# EAGLE design Logical_EPS v.1.0 (EAGLE 9.2.2)
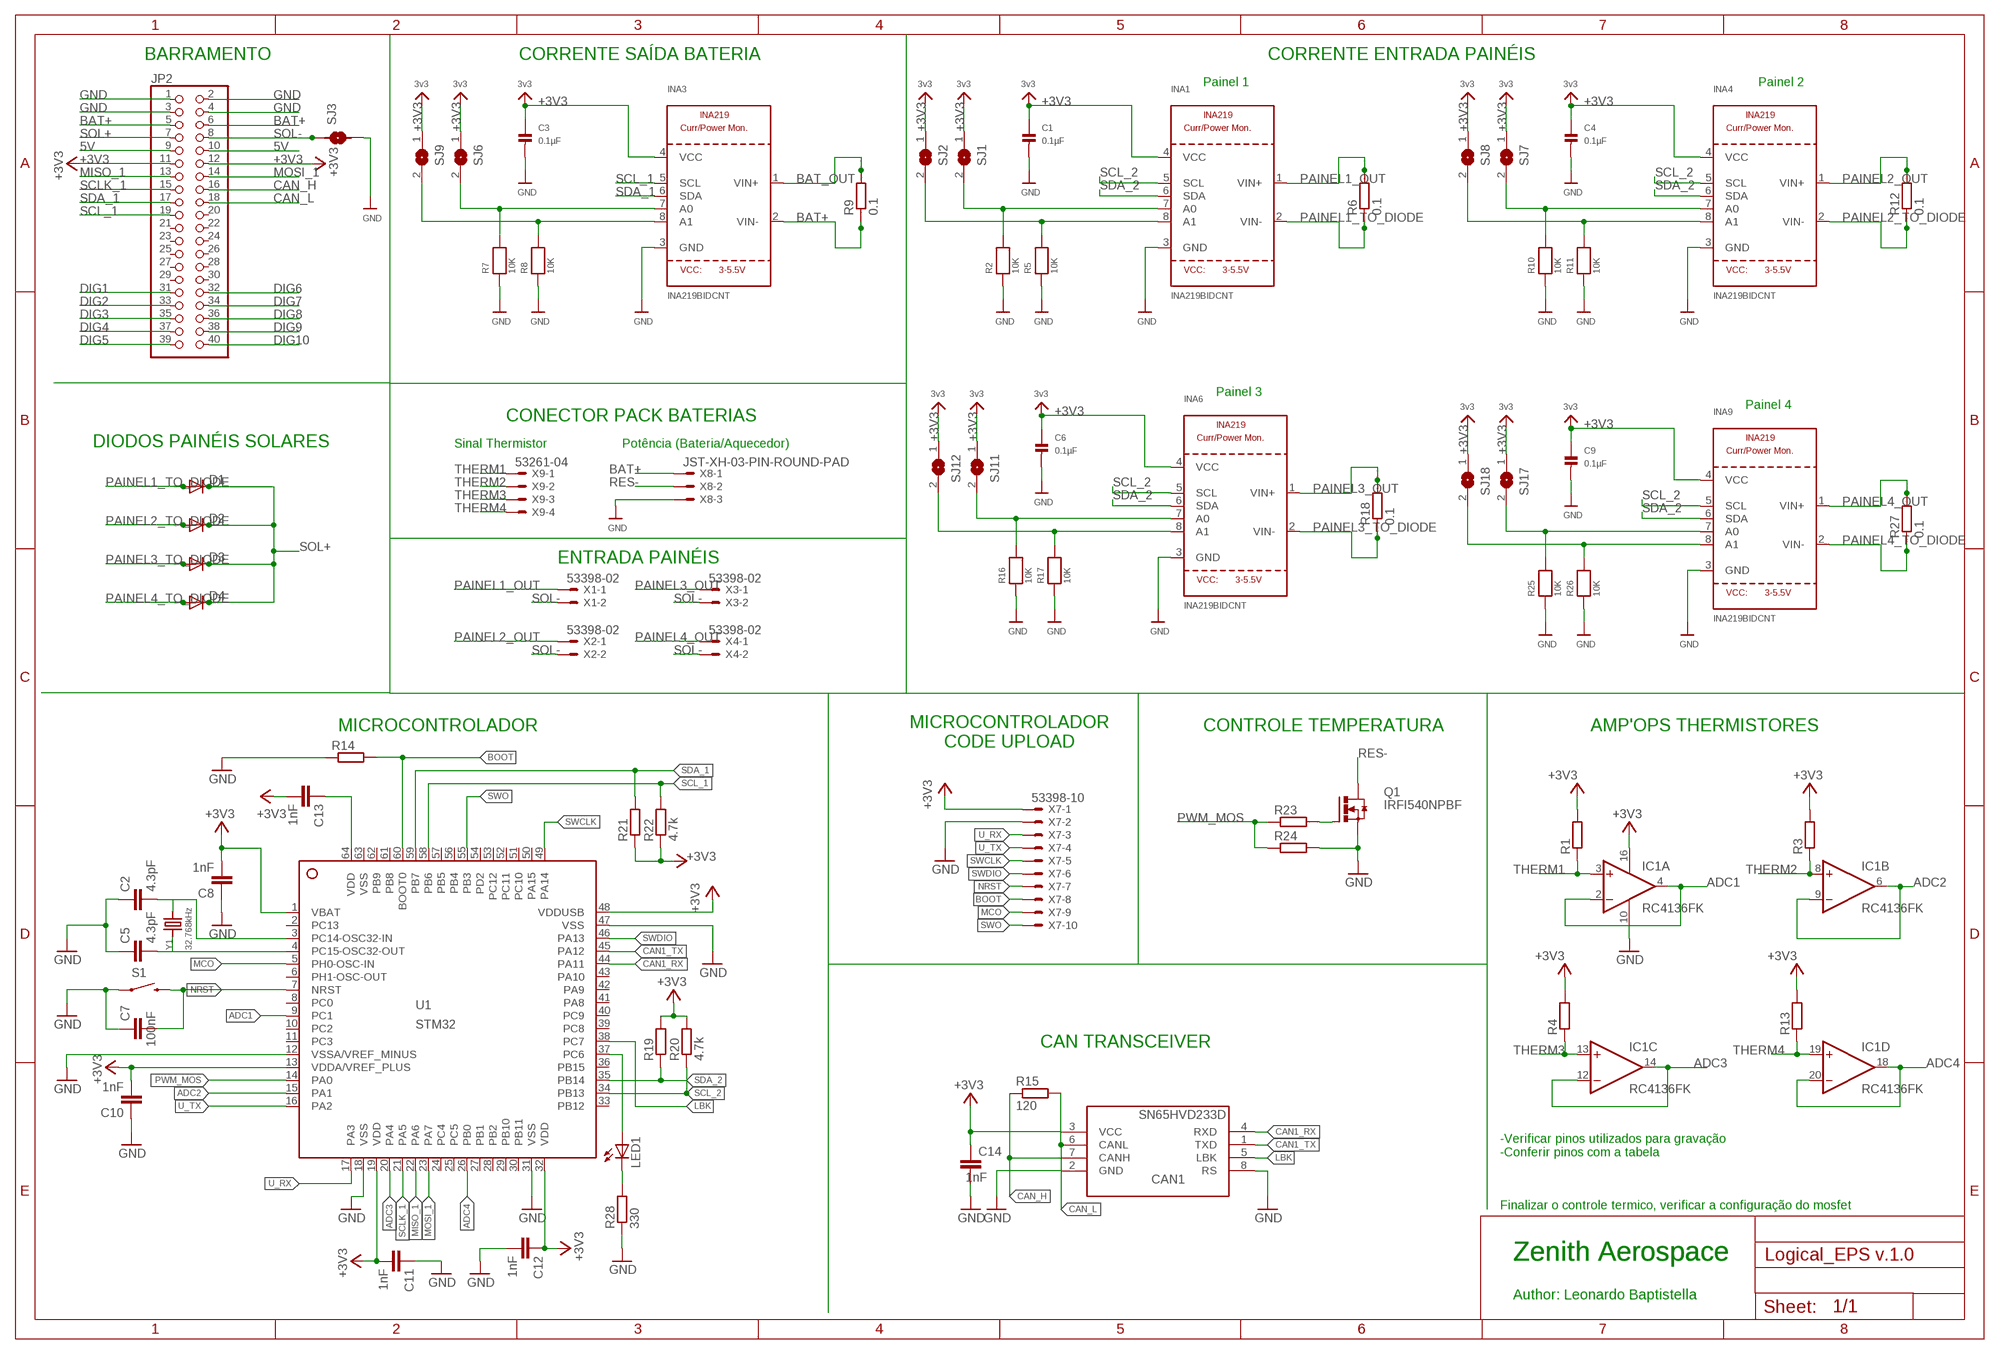
[diagram p0: schematic, sheet 1]

## Parts
C1  0.1µF  CAP_CERAMIC1206  [1206]
C2  4.3pF  C-EUC1206  [C1206]
C3  0.1µF  CAP_CERAMIC1206  [1206]
C4  0.1µF  CAP_CERAMIC1206  [1206]
C5  4.3pF  C-EUC1206  [C1206]
C6  0.1µF  CAP_CERAMIC1206  [1206]
C7  100nF  C-EUC1206  [C1206]
C8  1nF  C-EUC1206  [C1206]
C9  0.1µF  CAP_CERAMIC1206  [1206]
C10  1nF  C-EUC1206  [C1206]
C11  1nF  C-EUC1206  [C1206]
C12  1nF  C-EUC1206  [C1206]
C13  1nF  C-EUC1206  [C1206]
C14  1nF  C-EUC1206  [C1206]
CAN1  SN65HVD233D  [SOIC8]
D1  DIODE-DO-214AC  [DO-214AC]
D2  DIODE-DO-214AC  [DO-214AC]
D3  DIODE-DO-214AC  [DO-214AC]
D4  DIODE-DO-214AC  [DO-214AC]
IC1  RC4136FK  [PLCC20S]
INA1  INA219BIDCNT  INA219  [SOT23-8]
INA3  INA219BIDCNT  INA219  [SOT23-8]
INA4  INA219BIDCNT  INA219  [SOT23-8]
INA6  INA219BIDCNT  INA219  [SOT23-8]
INA9  INA219BIDCNT  INA219  [SOT23-8]
JP2  PINHD-2X20  [2X20]
LED1  LEDSMT1206  [1206]
Q1  IRFI540NPBF  [TO220BH]
R1  R-EU_R1206  [R1206]
R2  10K  RESISTOR1206  [1206]
R3  R-EU_R1206  [R1206]
R4  R-EU_R1206  [R1206]
R5  10K  RESISTOR1206  [1206]
R6  0.1  RR2512  [R2512]
R7  10K  RESISTOR1206  [1206]
R8  10K  RESISTOR1206  [1206]
R9  0.1  RR2512  [R2512]
R10  10K  RESISTOR1206  [1206]
R11  10K  RESISTOR1206  [1206]
R12  0.1  RR2512  [R2512]
R13  R-EU_R1206  [R1206]
R14  R-EU_R1206  [R1206]
R15  120  R-EU_R1206  [R1206]
R16  10K  RESISTOR1206  [1206]
R17  10K  RESISTOR1206  [1206]
R18  0.1  RR2512  [R2512]
R19  4.7k  R-EU_R1206  [R1206]
R20  4.7k  R-EU_R1206  [R1206]
R21  4.7k  R-EU_R1206  [R1206]
R22  4.7k  R-EU_R1206  [R1206]
R23  R-EU_R1206  [R1206]
R24  R-EU_R1206  [R1206]
R25  10K  RESISTOR1206  [1206]
R26  10K  RESISTOR1206  [1206]
R27  0.1  RR2512  [R2512]
R28  330  R-EU_R1206  [R1206]
S1  SWITCH-MOMENTARY-2SMD-1101NE  [TACTILE-SWITCH-1101NE]
SJ1  SOLDERJUMPERREFLOW_NOPASTE  [SOLDERJUMPER_REFLOW_NOPASTE]
SJ2  SOLDERJUMPERREFLOW_NOPASTE  [SOLDERJUMPER_REFLOW_NOPASTE]
SJ3  SMD-JUMPER-2  [SMD-JUMPER-2]
SJ6  SOLDERJUMPERREFLOW_NOPASTE  [SOLDERJUMPER_REFLOW_NOPASTE]
SJ7  SOLDERJUMPERREFLOW_NOPASTE  [SOLDERJUMPER_REFLOW_NOPASTE]
SJ8  SOLDERJUMPERREFLOW_NOPASTE  [SOLDERJUMPER_REFLOW_NOPASTE]
SJ9  SOLDERJUMPERREFLOW_NOPASTE  [SOLDERJUMPER_REFLOW_NOPASTE]
SJ11  SOLDERJUMPERREFLOW_NOPASTE  [SOLDERJUMPER_REFLOW_NOPASTE]
SJ12  SOLDERJUMPERREFLOW_NOPASTE  [SOLDERJUMPER_REFLOW_NOPASTE]
SJ17  SOLDERJUMPERREFLOW_NOPASTE  [SOLDERJUMPER_REFLOW_NOPASTE]
SJ18  SOLDERJUMPERREFLOW_NOPASTE  [SOLDERJUMPER_REFLOW_NOPASTE]
U1  STM32  STM32L476RCT6  [LQFP64_10X10]
X1  53398-02  [53398-02]
X2  53398-02  [53398-02]
X3  53398-02  [53398-02]
X4  53398-02  [53398-02]
X7  53398-10  [53398-10]
X8  JST-XH-03-PIN-ROUND-PAD  [JST-XH-03-PACKAGE-ROUND-PAD]
X9  53261-04  [53261-04]
Y1  32.768kHz  CRYSTAL8X3.8SMT  [CRYSTAL_8X3.8]

## Nets
5V: JP2.9 JP2.10
+3V3: C1.1 C3.1 C4.1 C6.1 C8.2 C9.1 C10.2 C11.2 C12.1 C13.2 C14.1 CAN1.3(VCC) IC1.16(E:V+) INA1.4(VCC) INA3.4(VCC) INA4.4(VCC) INA6.4(VCC) INA9.4(VCC) JP2.11 JP2.12 R1.2 R3.2 R4.2 R13.2 R19.2 R20.2 R21.1 R22.1 SJ1.1 SJ2.1 SJ6.1 SJ7.1 SJ8.1 SJ9.1 SJ11.1 SJ12.1 SJ17.1 SJ18.1 U1.1(VBAT) U1.13(VDDA/VREF_PLUS) U1.19(VDD) U1.32(VDD) U1.48(VDDUSB) X7.1 ; supply symbol labelled 3v3
ADC1: IC1.2(A:-IN) IC1.4(A:OUT) U1.9(PC1)
ADC2: IC1.6(B:OUT) IC1.9(B:-IN) U1.15(PA1)
ADC3: IC1.12(C:-IN) IC1.14(C:OUT) U1.20(PA4)
ADC4: IC1.18(D:OUT) IC1.20(D:-IN) U1.26(PB0)
BAT+: INA3.2(VIN-) JP2.5 JP2.6 R9.1 X8.1
BAT_OUT: INA3.1(VIN+) R9.2
BOOT: R14.2 U1.60(BOOT0) X7.8
CAN1_RX: CAN1.4(RXD) U1.44(PA11)
CAN1_TX: CAN1.1(TXD) U1.45(PA12)
CAN_H: CAN1.7(CANH) JP2.16 R15.1
CAN_L: CAN1.6(CANL) JP2.18 R15.2
DIG1: JP2.31
DIG2: JP2.33
DIG3: JP2.35
DIG4: JP2.37
DIG5: JP2.39
DIG6: JP2.32
DIG7: JP2.34
DIG8: JP2.36
DIG9: JP2.38
DIG10: JP2.40
GND: C1.2 C2.1 C3.2 C4.2 C5.1 C6.2 C7.1 C8.1 C9.2 C10.1 C11.1 C12.2 C14.2 CAN1.2(GND) CAN1.8(RS) IC1.10(E:V-) INA1.3(GND) INA3.3(GND) INA4.3(GND) INA6.3(GND) INA9.3(GND) JP2.1 JP2.2 JP2.3 JP2.4 Q1.S R2.1 R5.1 R7.1 R8.1 R10.1 R11.1 R14.1 R16.1 R17.1 R24.2 R25.1 R26.1 R28.1 S1.1 SJ3.2 U1.12(VSSA/VREF_MINUS) U1.18(VSS) U1.31(VSS) U1.47(VSS) X7.2 X8.3
LBK: CAN1.5(LBK) U1.38(PC7)
MCO: U1.5(PH0-OSC-IN) X7.9
MISO_1: JP2.13 U1.22(PA6)
MOSI_1: JP2.14 U1.23(PA7)
N$2: C2.2 U1.3(PC14-OSC32-IN) Y1.P$4
N$3: Q1.G R23.2
N$4: C5.2 U1.4(PC15-OSC32-OUT) Y1.P$1
N$5: C13.1 U1.64(VDD)
N$6: INA1.8(A1) R5.2 SJ2.2
N$7: INA1.7(A0) R2.2 SJ1.2
N$8: INA3.8(A1) R8.2 SJ9.2
N$9: INA3.7(A0) R7.2 SJ6.2
N$10: INA4.8(A1) R11.2 SJ8.2
N$11: INA4.7(A0) R10.2 SJ7.2
N$12: LED1.A U1.37(PC6)
N$13: LED1.C R28.2
N$14: INA6.8(A1) R17.2 SJ12.2
N$15: INA6.7(A0) R16.2 SJ11.2
N$20: INA9.8(A1) R26.2 SJ18.2
N$21: INA9.7(A0) R25.2 SJ17.2
NRST: C7.2 S1.2 U1.7(NRST) X7.7
PAINEL1_OUT: INA1.1(VIN+) R6.2 X1.1
PAINEL1_TO_DIODE: D1.A INA1.2(VIN-) R6.1
PAINEL2_OUT: INA4.1(VIN+) R12.2 X2.1
PAINEL2_TO_DIODE: D2.A INA4.2(VIN-) R12.1
PAINEL3_OUT: INA6.1(VIN+) R18.2 X3.1
PAINEL3_TO_DIODE: D3.A INA6.2(VIN-) R18.1
PAINEL4_OUT: INA9.1(VIN+) R27.2 X4.1
PAINEL4_TO_DIODE: D4.A INA9.2(VIN-) R27.1
PWM_MOS: R23.1 R24.1 U1.14(PA0)
RES-: Q1.D X8.2
SCL_1: INA3.5(SCL) JP2.19 R22.2 U1.58(PB6)
SCL_2: INA1.5(SCL) INA4.5(SCL) INA6.5(SCL) INA9.5(SCL) R20.1 U1.34(PB13)
SCLK_1: JP2.15 U1.21(PA5)
SDA_1: INA3.6(SDA) JP2.17 R21.2 U1.59(PB7)
SDA_2: INA1.6(SDA) INA4.6(SDA) INA6.6(SDA) INA9.6(SDA) R19.1 U1.35(PB14)
SOL+: D1.C D2.C D3.C D4.C JP2.7
SOL-: JP2.8 SJ3.1 X1.2 X2.2 X3.2 X4.2
SWCLK: U1.49(PA14) X7.5
SWDIO: U1.46(PA13) X7.6
SWO: U1.55(PB3) X7.10
THERM1: IC1.3(A:+IN) R1.1 X9.1
THERM2: IC1.8(B:+IN) R3.1 X9.2
THERM3: IC1.13(C:+IN) R4.1 X9.3
THERM4: IC1.19(D:+IN) R13.1 X9.4
U_RX: U1.17(PA3) X7.3
U_TX: U1.16(PA2) X7.4
Unconnected: IC1.1(1:NC) IC1.5(5:NC) IC1.7(7:NC) IC1.11(11:NC) IC1.15(15:NC) IC1.17(17:NC) JP2.20 JP2.21 JP2.22 JP2.23 JP2.24 JP2.25 JP2.26 JP2.27 JP2.28 JP2.29 JP2.30 U1.2(PC13) U1.6(PH1-OSC-OUT) U1.8(PC0) U1.10(PC2) U1.11(PC3) U1.24(PC4) U1.25(PC5) U1.27(PB1) U1.28(PB2) U1.29(PB10) U1.30(PB11) U1.33(PB12) U1.36(PB15) U1.39(PC8) U1.40(PC9) U1.41(PA8) U1.42(PA9) U1.43(PA10) U1.50(PA15) U1.51(PC10) U1.52(PC11) U1.53(PC12) U1.54(PD2) U1.56(PB4) U1.57(PB5) U1.61(PB8) U1.62(PB9)

## Notes on the sheet
- BARRAMENTO | CORRENTE SAÍDA BATERIA | CORRENTE ENTRADA PAINÉIS
- Painel 1 | Painel 2
- Painel 3
- Painel 4
- CONECTOR PACK BATERIAS
- DIODOS PAINÉIS SOLARES | Sinal Thermistor | Potência (Bateria/Aquecedor)
- ENTRADA PAINÉIS
- MICROCONTROLADOR
- MICROCONTROLADOR
  CODE UPLOAD
- CONTROLE TEMPERATURA | AMP'OPS THERMISTORES
- CAN TRANSCEIVER
- -Verificar pinos utilizados para gravação
  -Conferir pinos com a tabela
- Finalizar o controle termico, verificar a configuração do mosfet
- Zenith Aerospace | Zenith Aerospace
- Author: Leonardo Baptistella

## Power pins joined to a net without a drawn wire
VSS: U1.63(VSS)

## Library data of the parts
C1 C3 C4 C6 C9 = microbuilder:CAP_CERAMIC: Ceramic Capacitors 0402 - 0402 Surface Mount Capacitors 16pF 50V 5% [Digikey: 445-4899-2-ND] 18pF 50V 5% [Digikey: 490-1281-2-ND] 22pF 50V 5% [Digikey: 490-1283-2-ND] 68pF 50V 5% [Digikey: 490-1289-2-ND] 0.1uF 10V 10% [Digikey: 490-1318-2-ND] 1.0uF 6.3V 10% [Digikey: 490-1320-2-ND] 0603 - 0603 Surface Mount Capacitors 16 pF 50V 5% [Digikey: 445-5051-2-ND] 22 pF 50V [Digikey: PCC220ACVTR-ND] 33 pF 50V 5% [Digikey: 490-1415-1-ND] 56pF 50V 5% [Digikey: 490-1421-1-ND] 220pF 50V 5% [Digikey: 445-1285-1-ND] 680 pF 50V 2200 pF 50V 5% C0G [Digikey: 445-1297-1-ND] 5600 pF 100V 5% X7R [Digikey: 478-3711-1-ND] 0.1 µF 25V 10% [Digikey: PCC2277TR-ND] 0.22 µF 16V 10% X7R [Digikey: 445-1318-1-ND] 1.0 µF 25V 10% [Digikey: 445-5146-2-ND] 0603 - RF Specific 3pF 250V +/-0.1pF RF [Digikey: 712-1347-1-ND] 18 pF 250V 5% [Digikey: 478-3505-1-ND or 712-1322-1-ND] 56 pF 250V 5% C0G RF [Digikey: 490-4867-1-ND] 68 pF 250V RF [Digikey: 490-4868-1-ND] 0805 - 0805 Surface Mount Capacitors 220 pF 250V 2% RF Ceramic Capacitor [Digikey: 712-1398-1-ND] 1000 pF 50V 2% NP0 Ceramic Capacitor [Digikey: 478-3760-1-ND] 0.1 µF 25V 10% Ceramic Capacitor [Digikey: PCC1828TR-ND] 1.0 µF 16V 10% Ceramic Capacitor[Digikey: 490-1691-2-ND] 10.0 µF 10V 10% Ceramic Capacitor[Digikey: 709-1228-1-ND] 10.0 uF 16V 10% Ceramic Capacitor [Digikey: 478-5165-2-ND] 47 uF 6.3V 20% Ceramic Capacitor [Digikey: 587-1779-1-ND or 399-5506-1-ND] 1206 - 1206 Surface Mount Capacitors 47uF 10V 20% Ceramic Capacitor [Digikey: 490-5528-1-ND or 399-5508-1-ND or 445-6010-1-ND] 100uF 6.3V -20%, +80% Y5V Ceramic Capacitor (Digikey: 490-4512-1-ND, Mouser: 81-GRM31CF50J107ZE1L)
C2 C5 C7 C8 C10-C14 = rcl:C-EU: CAPACITOR, European symbol; SPICEPREFIX: C
CAN1 = SN65HVD233D:SN65HVD233D; AVAILABILITY: Unavailable; DESCRIPTION: 3.3V CAN Transceiver with Standby Mode, Loop-back 8-SOIC -40 to 125; MF: Texas Instruments; MP: SN65HVD233D; PACKAGE: SOIC-8 Texas Instruments; PRICE: None
D1-D4 = diode:DIODE-: DIODE
IC1 = linear4:RC4136FK: OP AMP
INA1 INA3 INA4 INA6 INA9 = microbuilder:INA219: INA219 - I2C Current/Power Monitor Voltage Range: 0-26V Accuracy: 0.5% Temperature: -40°C - 125°C
JP2 = pinhead:PINHD-2X20: PIN HEADER
LED1 = led:LED: LED OSRAM: - CHIPLED LG R971, LG N971, LY N971, LG Q971, LY Q971, LO R971, LY R971 LH N974, LH R974 LS Q976, LO Q976, LY Q976 LO Q996 - Hyper CHIPLED LW Q18S LB Q993, LB Q99A, LB R99A - SideLED LS A670, LO A670, LY A670, LG A670, LP A670 LB A673, LV A673, LT A673, LW A673 LH A674 LY A675 LS A676, LA A676, LO A676, LY A676, LW A676 LS A679, LY A679, LG A679 - Hyper Micro SIDELED® LS Y876, LA Y876, LO Y876, LY Y876 LT Y87S - SmartLED LW L88C, LW L88S LB L89C, LB L89S, LG L890 LS L89K, LO L89K, LY L89K LS L896, LA L896, LO L896, LY L896 - TOPLED LS T670, LO T670, LY T670, LG T670, LP T670 LSG T670, LSP T670, LSY T670, LOP T670, LYG T670 LG T671, LOG T671, LSG T671 LB T673, LV T673, LT T673, LW T673 LH T674 LS T676, LA T676, LO T676, LY T676, LB T676, LH T676, LSB T676, LW T676 LB T67C, LV T67C, LT T67C, LS T67K, LO T67K, LY T67K, LW E67C LS E67B, LA E67B, LO E67B, LY E67B, LB E67C, LV E67C, LT E67C LW T67C LS T679, LY T679, LG T679 LS T770, LO T770, LY T770, LG T770, LP T770 LB T773, LV T773, LT T773, LW T773 LH T774 LS E675, LA E675, LY E675, LS T675 LS T776, LA T776, LO T776, LY T776, LB T776 LHGB T686 LT T68C, LB T68C - Hyper Mini TOPLED® LB M676 - Mini TOPLED Santana® LG M470 LS M47K, LO M47K, LY M47K Source: http://www.osram.convergy.de LUXEON: - LUMILED® LXK2-PW12-R00, LXK2-PW12-S00, LXK2-PW14-U00, LXK2-PW14-V00 LXK2-PM12-R00, LXK2-PM12-S00, LXK2-PM14-U00 LXK2-PE12-Q00, LXK2-PE12-R00, LXK2-PE12-S00, LXK2-PE14-T00, LXK2-PE14-U00 LXK2-PB12-K00, LXK2-PB12-L00, LXK2-PB12-M00, LXK2-PB14-N00, LXK2-PB14-P00, LXK2-PB14-Q00 LXK2-PR12-L00, LXK2-PR12-M00, LXK2-PR14-Q00, LXK2-PR14-R00 LXK2-PD12-Q00, LXK2-PD12-R00, LXK2-PD12-S00 LXK2-PH12-R00, LXK2-PH12-S00 LXK2-PL12-P00, LXK2-PL12-Q00, LXK2-PL12-R00 Source: www.luxeon.com KINGBRIGHT: KA-3528ASYC Source: www.kingbright.com
Q1 = transistor-power:IRFI540NPBF: HEXFET Power MOISFET VDSS = 100V, RDS(on) = 0.052 Ohm, ID = 20A, VGS(th) = 2.0 -- 4.0V Source: http://www.irf.com/product-info/datasheets/data/irfi540npbf.pdf
R1 R3 R4 R13-R15 R19-R24 R28 = rcl:R-EU_: RESISTOR, European symbol; SPICEPREFIX: R
R2 R5 R7 R8 R10 R11 R16 R17 R25 R26 = microbuilder:RESISTOR: Resistors 0402 - 0402 Surface Mount Package 22 Ohm 1% 1/16W [Digikey: 311-22.0LRTR-ND] 33 Ohm 5% 1/16W 1.0K 5% 1/16W 1.5K 5% 1/16W 2.0K 1% 1/16W 10.0K 1% 1/16W [Digikey: 311-10.0KLRTR-ND] 10.0K 5% 1/16W [Digikey: RMCF0402JT10K0TR-ND] 12.1K 1% 1/16W [Digikey: 311-22.0LRTR-ND] 100.0K 5% 1/16W 0603 - 0603 Surface Mount Package 0 Ohm 1/10 Watt 1% Resistor 15 Ohm 1/10 Watt 1% Resistor 33 Ohm 1/10 Watt 1% Resistor 49.9 Ohm 1/10 Watt 1% Resistor 100 Ohm 1/10 Watt 1% Resistor 150 Ohm 1/10 Watt 1% Resistor 240 Ohm 1/10 Watt 1% Resistor 390 Ohm 1/10 Watt 1% Resistor 560 Ohm 1/10 Watt 1% Resistor 680 Ohm 1/10 Watt 1% Resistor 750 Ohm 1/10 Watt 1% Resistor 1.0K Ohm 1/10 Watt 1% Resistor 1.5K Ohm 1/10 Watt 1% Resistor 2.0K Ohm 1/10 Watt 1% Resistor 2.2K Ohm 1/10 Watt 1% Resistor 3.3K Ohm 1/10 Watt 1% Resistor 4.7K Ohm 1/10 Watt 1% Resistor 10.0K Ohm 1/10 Watt 1% Resistor 12.0K Ohm 1/10 Watt 1% Resistor 12.1K Ohm 1/10 Watt 1% Resistor 20.0K Ohm 1/10 Watt 1% Resistor 33.0K Ohm 1/10 Watt 1% Resistor 100.0K Ohm 1/10 Watt 1% Resistor 0805 - 0805 Surface Mount Package 0 Ohm 1/8 Watt 1% Resistor 33 Ohm 1/8 Watt 1% Resistor 100 Ohm 1/8 Watt 1% Resistor 150 Ohm 1/8 Watt 1% Resistor 200 Ohm 1/8 Watt 1% Resistor 240 Ohm 1/8 Watt 1% Resistor 330 Ohm 1/8 Watt 1% Resistor 390 Ohm 1/8 Watt 1% Resistor 470 Ohm 1/8 Watt 1% Resistor 1.0K Ohm 1/8 Watt 1% Resistor 1.5K Ohm 1/8 Watt 1% Resistor 2.0K Ohm 1/8 Watt 1% Resistor 4.7K Ohm 1/8 Watt 1% Resistor 5.1K Ohm 1/8 Watt 1% Resistor 5.6K Ohm 1/8 Watt 1% Resistor 10.0K Ohm 1/8 Watt 1% Resistor 22.0K Ohm 1/8 Watt 1% Resistor 33.0K Ohm 1/8 Watt 1% Resistor 100K Ohm 1/8 Watt 1% Resistor 1206 - 1206 Surface Mount Package 2012 - 2010 Surface Mount Package 0.11 Ohm 1/2 Watt 1% Resistor - Digikey: RHM.11UCT-ND
R6 R9 R12 R18 R27 = eagle-ltspice:R: RESISTOR, European symbol; SPICEMODEL: NONE; SPICEPREFIX: R
S1 = SparkFun-Electromechanical:SWITCH-MOMENTARY-2: Various NO switches- pushbuttons, reed, etc; PROD_ID: SWCH-00815
SJ1 SJ2 SJ6-SJ9 SJ11 SJ12 SJ17 SJ18 = microbuilder:SOLDERJUMPER: SMD Solder JUMPER Solder the two pads together to create a connection, or remove the solder to break it. REFLOW - Use this footprint for solder paste and reflow ovens. WAVE - Use this footprint for hand-soldering (larger pads). CLOSED - Has a trace between the two pads to ensure it is closed by default. The trace needs to be cut to disable the jumper, and can be closed again by creating a solder bridge between the two pads.
SJ3 = FaBo-etc:SMD-JUMPER-2
U1 = STM32L4xxx:STM32L476R*: STM32L476RX LQFP100 Datasheet STM32L476XX; FARNELL: 2518170; FLASH: 256kB; SRAM: 128kB
X1-X4 = con-molex:53?-02: CONNECTOR wire to board 1.25 mm (.049 inch) pitch header; MF: MOLEX; OC_FARNELL: unknown; OC_NEWARK: unknown
X7 = con-molex:53?-10: CONNECTOR wire to board 1.25 mm (.049 inch) pitch header; MF: MOLEX; MPN: 53398-1071; OC_FARNELL: unknown; OC_NEWARK: 59J0425
X8 = Rembrandt Electronics - JST XH Connectors v1-0:JST-XH-03-PIN: JST XH Connector 2 Pin Wire to board connector. Pitch: 2,54 mm, (0.100") Number of pins: 3 Created by Rembrandt Electronics www.rembrandtelectronics.com
X9 = con-molex:53?-04: CONNECTOR wire to board 1.25 mm (.049 inch) pitch header; MF: MOLEX; OC_FARNELL: 1125374; OC_NEWARK: unknown
Y1 = microbuilder:CRYSTAL: Crystals HC49UP - Surface Mount Crystal 4.0MHz 18pF +/-30ppm Surface Mount Crystal [Digikey: 535-9857-1-ND] 12.0 MHz Surface Mount Crystal [Digikey: 535-9869-6-ND] 25.0 MHz Surface Mount Crystal [Digikey: 535-9078-1-ND] 2.5 x 2.0mm - MEMs SMT Crystal 16.0 MHz 10pF 20ppm 2.5 x 2.0mm Crystal [Digikey -40-85°C: 535-10923-1-ND] 3.2 x 2.5mm - MEMs SMT Crystal 12.0 MHz 8pF 15ppm 3.2 x 2.5mm Crystal [Digikey: -10-70°C: 644-1047-1-ND -40-125°C: 644-1128-1-ND] 16.0 MHz 8pF 15ppm 3.2 x 2.5mm Crystal [Digikey: -10-70°C: 644-1049-1-ND -40-125°C: 644-1129-2-ND] 16.0 MHz 10pF 10ppm 3.2 x 2.5mm Crystal [Digikey: 644-1100-1-ND] 27.12 MHz 18pF 30ppm 3.2 x 2.5mm Crystal [Digikey: 887-1424-1-ND] 27.12MHz 10pF 10ppm 3.2 x 2.5mm Crystal [Digikey: 887-1329-1-ND] 4.9 x 1.8mm - MEMs SMT Crystal 32.768 KHz 12.5pF 20ppm 4.9 x 1.8mm Crystal [Digikey: SE2415CT-ND] 8.0 x 3.8mm - Surface Mount Crystal 32.768kHz 12.5pF 20ppm -40°C-85°C [Digikey: 535-9166-2-ND] Cylinder 32.768KHz Cylinder Crystal (2x6mm body) [Ex. Digikey: 300-8341-2-ND]

## Board
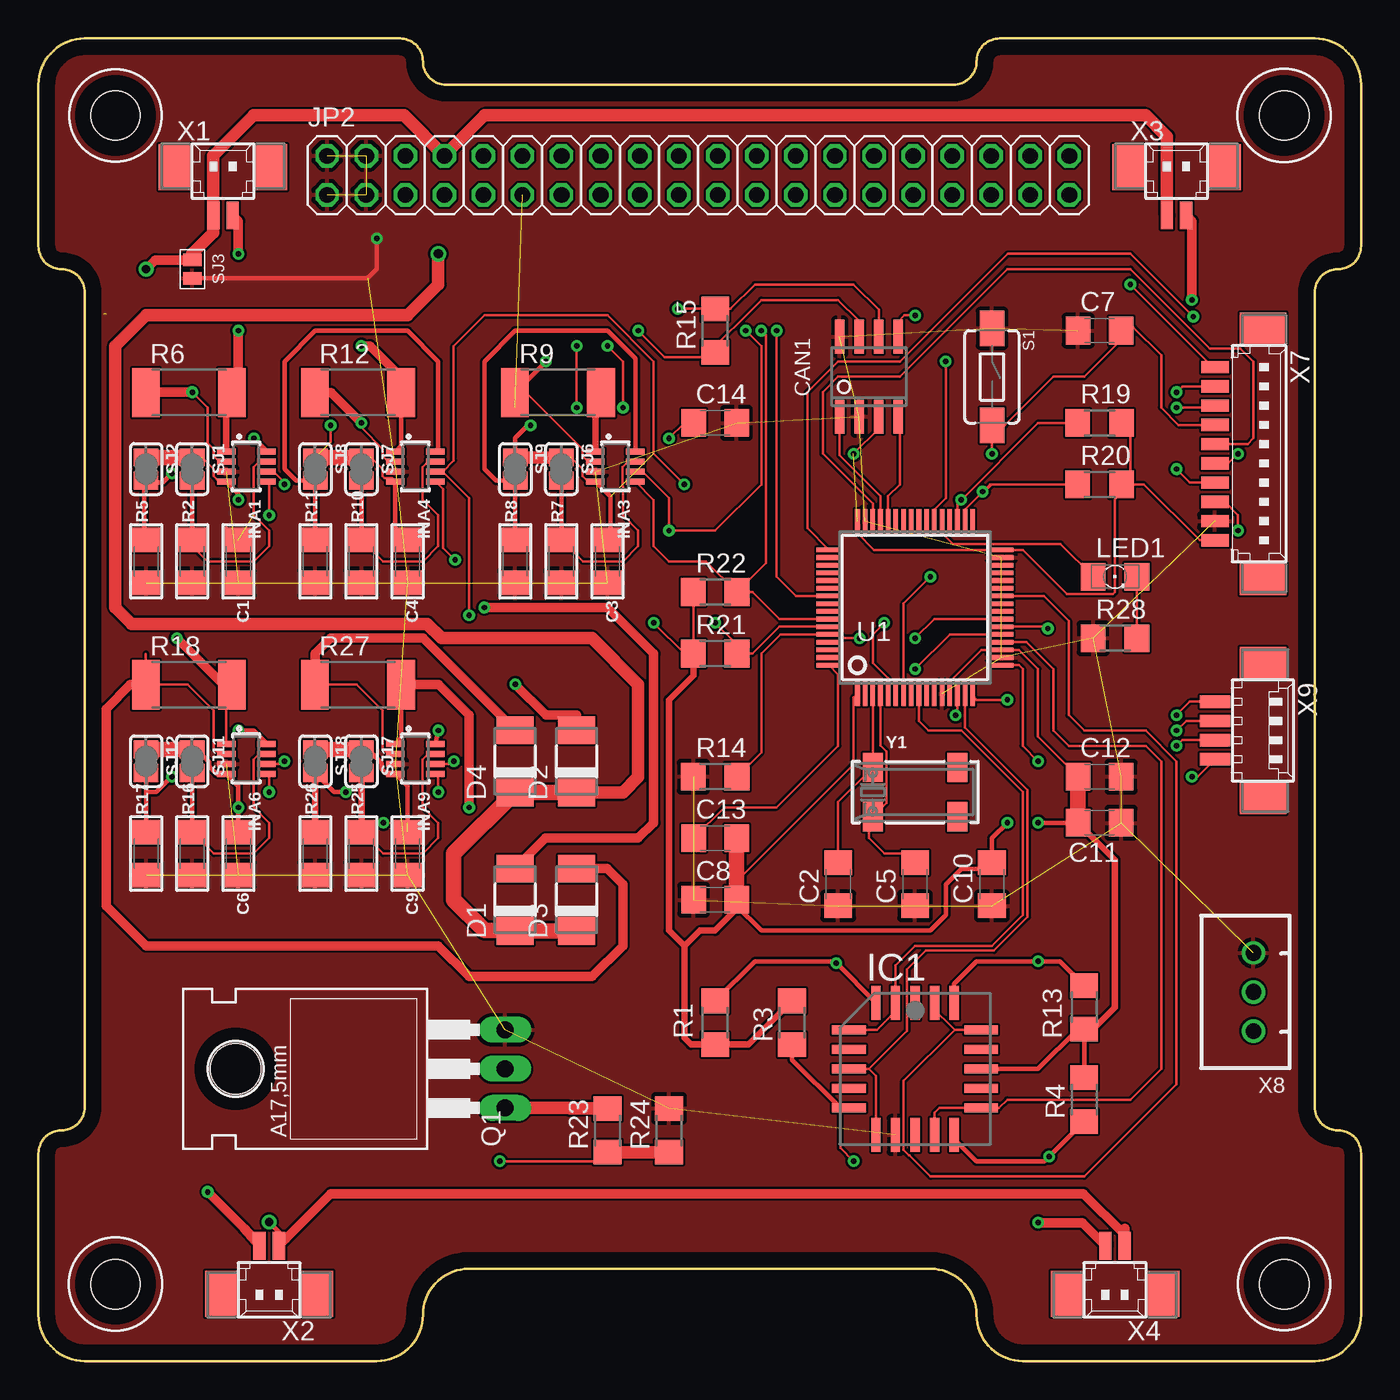
[diagram p1: board, top side]
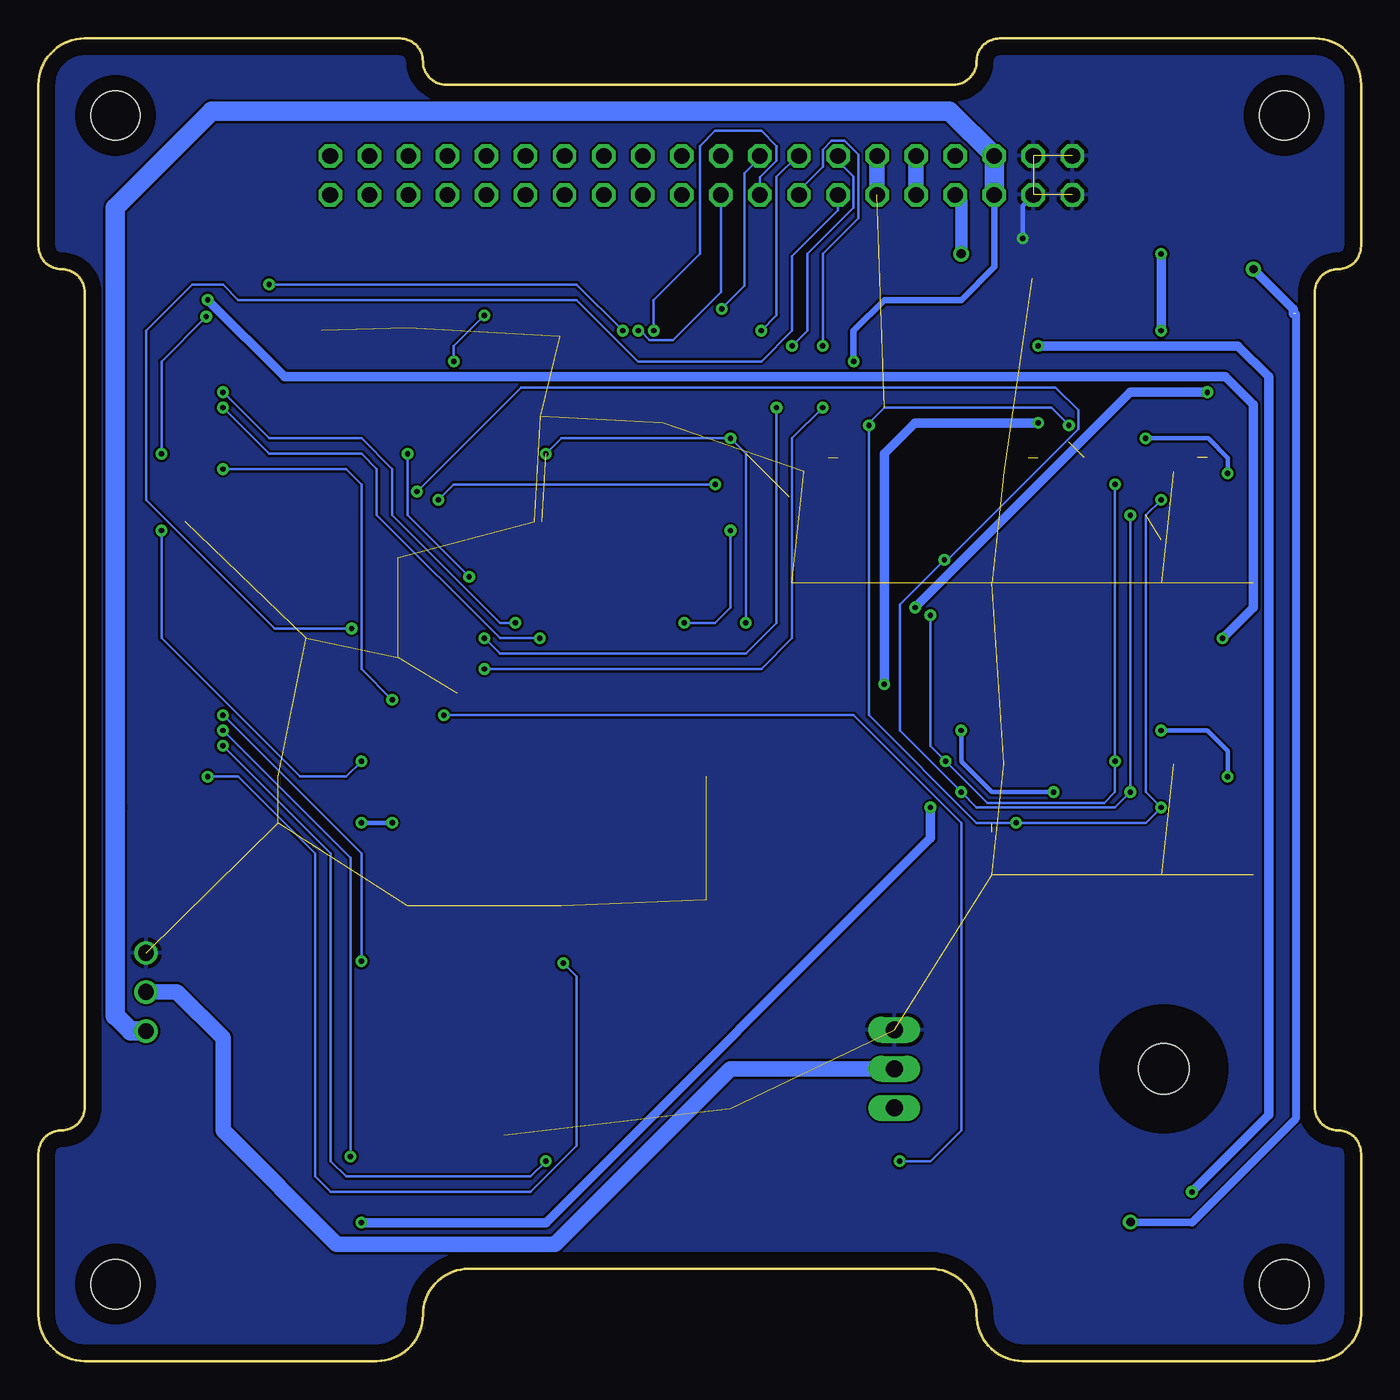
[diagram p2: board, bottom side, seen from below]

Size 86 x 86 mm. Coordinates in mm from the lower left corner, seen from the top.
Outline: 0,83 0,72.5 arc90 1.5,71 arc-90 3,69.5 3,16.5 arc-90 1.5,15 arc90 0,13.5 0,3 arc90 3,0 22,0 arc90 25,3 arc-90 28,6 58,6 arc-90 61,3 arc90 64,0 83,0 arc90 86,3 86,13.5 arc90 84.5,15 arc-90 83,16.5 83,69.5 arc-90 84.5,71 arc90 86,72.5 86,83 arc90 83,86 62.5,86 arc90 61,84.5 arc-90 59.5,83 26.5,83 arc-90 25,84.5 arc90 23.5,86 3,86 arc90 0,83
Copper layers (1*16): Top 0.035mm / dielectric 1.5mm / Bottom 0.035mm
Design rules "default *": minimum track width 6mil, minimum drill 0.35mm, track to track 6mil, track to pad 6mil, pad to pad 6mil, via to via 6mil, smd to smd 6mil, copper to edge 40mil, drill to drill 6mil, minimum pad ring 10mil, minimum via ring 8mil, stop-mask expansion 4mil, vias tented up to drill 30mil, thermal gap 10mil
Holes 3.2 mm at 5,5 81,5 81,81 5,81

### Footprints (pad centres in the part's own frame; a part is rotated, then mirrored left to right if it is on the bottom)
1206 = smd 1.6 x 1.8: 1 -1.4,0; 2 1.4,0
C1206 = smd 1.6 x 1.8: 1 -1.4,0; 2 1.4,0
SOIC8 = smd 0.6 x 2.2: 1 -1.905,-2.6; 2 -0.635,-2.6; 3 0.635,-2.6; 4 1.905,-2.6; 5 1.905,2.6; 6 0.635,2.6; 7 -0.635,2.6; 8 -1.905,2.6
DO-214AC = smd 1.8 x 2.4: A 2.025,0; C -2.025,0
PLCC20S = smd 0.6 x 2.2: 1 0,4.3; 2 -1.27,4.3; 3 -2.54,4.3; 9 -2.54,-4.3; 10 -1.27,-4.3; 11 0,-4.3; 12 1.27,-4.3; 13 2.54,-4.3; 19 2.54,4.3; 20 1.27,4.3 | smd 2.2 x 0.6: 4 -4.3,2.54; 5 -4.3,1.27; 6 -4.3,0; 7 -4.3,-1.27; 8 -4.3,-2.54; 14 4.3,-2.54; 15 4.3,-1.27; 16 4.3,0; 17 4.3,1.27; 18 4.3,2.54
SOT23-8 = smd 0.4 x 1.2: 1 -0.975,-1.3; 2 -0.325,-1.3; 3 0.325,-1.3; 4 0.975,-1.3; 5 0.975,1.3; 6 0.325,1.3; 7 -0.325,1.3; 8 -0.975,1.3
2X20 = drill 1.016 octagon: 1 -24.13,-1.27; 2 -24.13,1.27; 3 -21.59,-1.27; 4 -21.59,1.27; 5 -19.05,-1.27; 6 -19.05,1.27; 7 -16.51,-1.27; 8 -16.51,1.27; 9 -13.97,-1.27; 10 -13.97,1.27; 11 -11.43,-1.27; 12 -11.43,1.27; 13 -8.89,-1.27; 14 -8.89,1.27; 15 -6.35,-1.27; 16 -6.35,1.27; 17 -3.81,-1.27; 18 -3.81,1.27; 19 -1.27,-1.27; 20 -1.27,1.27; 21 1.27,-1.27; 22 1.27,1.27; 23 3.81,-1.27; 24 3.81,1.27; 25 6.35,-1.27; 26 6.35,1.27; 27 8.89,-1.27; 28 8.89,1.27; 29 11.43,-1.27; 30 11.43,1.27; 31 13.97,-1.27; 32 13.97,1.27; 33 16.51,-1.27; 34 16.51,1.27; 35 19.05,-1.27; 36 19.05,1.27; 37 21.59,-1.27; 38 21.59,1.27; 39 24.13,-1.27; 40 24.13,1.27
1206' = smd 1.6 x 1.803: A -1.422,0; C 1.422,0
TO220BH = drill 1.118 long: D 0,-6.35; G -2.54,-6.35; S 2.54,-6.35 | hole 3.302: 0,11.176
R1206 = smd 1.6 x 1.803: 1 -1.422,0; 2 1.422,0
R2512 = smd 1.8 x 3.2: 1 -2.8,0; 2 2.8,0
TACTILE-SWITCH-1101NE = smd 2.3 x 1.6: 1 -3.15,0; 2 3.15,0
SOLDERJUMPER_REFLOW_NOPASTE = smd 1.168 x 1.6: 1 -0.762,0; 2 0.762,0
SMD-JUMPER-2 = smd 0.8 x 1.2: 1 -0.6,0; 2 0.6,0
LQFP64_10X10 = smd 0.3 x 1.6: 1 -3.75,-5.6; 2 -3.25,-5.6; 3 -2.75,-5.6; 4 -2.25,-5.6; 5 -1.75,-5.6; 6 -1.25,-5.6; 7 -0.75,-5.6; 8 -0.25,-5.6; 9 0.25,-5.6; 10 0.75,-5.6; 11 1.25,-5.6; 12 1.75,-5.6; 13 2.25,-5.6; 14 2.75,-5.6; 15 3.25,-5.6; 16 3.75,-5.6; 33 3.75,5.6; 34 3.25,5.6; 35 2.75,5.6; 36 2.25,5.6; 37 1.75,5.6; 38 1.25,5.6; 39 0.75,5.6; 40 0.25,5.6; 41 -0.25,5.6; 42 -0.75,5.6; 43 -1.25,5.6; 44 -1.75,5.6; 45 -2.25,5.6; 46 -2.75,5.6; 47 -3.25,5.6; 48 -3.75,5.6 | smd 1.6 x 0.3: 17 5.6,-3.75; 18 5.6,-3.25; 19 5.6,-2.75; 20 5.6,-2.25; 21 5.6,-1.75; 22 5.6,-1.25; 23 5.6,-0.75; 24 5.6,-0.25; 25 5.6,0.25; 26 5.6,0.75; 27 5.6,1.25; 28 5.6,1.75; 29 5.6,2.25; 30 5.6,2.75; 31 5.6,3.25; 32 5.6,3.75; 49 -5.6,3.75; 50 -5.6,3.25; 51 -5.6,2.75; 52 -5.6,2.25; 53 -5.6,1.75; 54 -5.6,1.25; 55 -5.6,0.75; 56 -5.6,0.25; 57 -5.6,-0.25; 58 -5.6,-0.75; 59 -5.6,-1.25; 60 -5.6,-1.75; 61 -5.6,-2.25; 62 -5.6,-2.75; 63 -5.6,-3.25; 64 -5.6,-3.75
53398-02 = smd 0.8 x 1.8: 1 0.625,-2.5; 2 -0.625,-2.5 | smd 2.1 x 3: S1 3.125,0.625; S2 -3.125,0.625
53398-10 = smd 0.8 x 1.8: 1 5.625,-2.5; 2 4.375,-2.5; 3 3.125,-2.5; 4 1.875,-2.5; 5 0.625,-2.5; 6 -0.625,-2.5; 7 -1.875,-2.5; 8 -3.125,-2.5; 9 -4.375,-2.5; 10 -5.625,-2.5 | smd 2.1 x 3: S1 8.125,0.625; S2 -8.125,0.625
JST-XH-03-PACKAGE-ROUND-PAD = drill 1.016: 1 -2.54,0; 2 0,0; 3 2.54,0
53261-04 = smd 0.8 x 2: 1 1.875,-2.5; 2 0.625,-2.5; 3 -0.625,-2.5; 4 -1.875,-2.5 | smd 2.1 x 3: S1 4.375,0.625; S2 -4.375,0.625
CRYSTAL_8X3.8 = smd 1.3 x 1.9: P$1 -2.75,-1.6; P$2 2.75,-1.6; P$3 2.75,1.6; P$4 -2.75,1.6

### Placement (x,y rotation side)
C1  13,52 270 top
C2  52,31 90 top
C3  37,52 270 top
C4  24,52 270 top
C5  57,31 90 top
C6  13,33 270 top
C7  69,67 0 top
C8  44,30 0 top
C9  24,33 270 top
C10  62,31 90 top
C11  69,35 180 top
C12  69,38 0 top
C13  44,34 0 top
C14  44,61 0 top
CAN1  54,64 0 top
D1  31,30 90 top
D2  35,39 90 top
D3  35,30 90 top
D4  31,39 90 top
IC1  57,19 0 top
INA1  13.51,58.16 270 top
INA3  37.51,58.16 270 top
INA4  24.51,58.16 270 top
INA6  13.51,39.16 270 top
INA9  24.51,39.16 270 top
JP2  42.9,77.1 0 top
LED1  [1206']  70,51 0 top
Q1  24,19 90 top
R1  44,22 270 top
R2  10,52 90 top
R3  49,22 90 top
R4  68,17 90 top
R5  7,52 90 top
R6  9.78,62.98 0 top
R7  34,52 90 top
R8  31,52 90 top
R9  33.78,62.98 0 top
R10  21,52 90 top
R11  18,52 90 top
R12  20.78,62.98 0 top
R13  68,23 270 top
R14  44,38 0 top
R15  44,67 90 top
R16  10,33 90 top
R17  7,33 90 top
R18  9.78,43.98 0 top
R19  69,61 0 top
R20  69,57 0 top
R21  44,46 0 top
R22  44,50 0 top
R23  37,15 90 top
R24  41,15 90 top
R25  21,33 90 top
R26  18,33 90 top
R27  20.78,43.98 0 top
R28  70,47 0 top
S1  62,64 270 top
SJ1  10,58 270 top
SJ2  7,58 270 top
SJ3  10,71 270 top
SJ6  34,58 270 top
SJ7  21,58 270 top
SJ8  18,58 270 top
SJ9  31,58 270 top
SJ11  10,39 270 top
SJ12  7,39 270 top
SJ17  21,39 270 top
SJ18  18,39 270 top
U1  57,49 0 top
X1  12,77 0 top
X2  15,5 180 top
X3  74,77 0 top
X4  70,5 180 top
X7  79,59 270 top
X8  79,24 90 top
X9  79,41 270 top
Y1  57,37 0 top

### Tracks (layer width: path | path; a pad name or v marks a point on that pad's centre or on a via)
5V
  Bottom 1.016: JP2.10 JP2.9
+3V3  (via drill 0.35)  (10 unrouted)
  Top 0.152: X7.1 75.5,53.38 71.88,57 71,57 | 71,57 R20.2 | R19.2 71,60.42 71,57 | U1.1 53,43.15 53,38.78 45.4,31.18 C8.2 | C12.1 65,40.6 65,45 63.75,46.25 U1.19 61.33,46.25 59.25,44.17 U1.13 | C11.2 67,35 66.88,35 | R22.1 R21.1 42,46 v40,48 | C14.1 42,61 v41,60 | 12.21,54.19 C1.1 | INA3.4 35.74,57.19 35.38,57.54 35.38,58.01 34.63,58.76 | INA4.4 23.2,57.2 22.99,57.41 22.52,57.41 22.38,57.54 22.38,58.01 21.63,58.76 | C4.1 23.2,54.2 | 12.2,57.2 11.72,57.2 11.38,57.54 11.38,58.01 10.63,58.76 | v22.43,35 24,35 | 19,59.76 v19,60.85 | v32,60.85 32,60.76 | 71,57 70,56 70,50 69.87,49.87 66.88,49.87 64,52.75 U1.32 54.33,52.75 53.25,53.83 U1.48 | CAN1.3 54.63,60.63 v53,59 | 23,38.19 INA9.4
  Top 0.305: 46,20.58 46.16,20.58 | R4.2 68,21 R13.2 67.58,21.58 65,19 IC1.16 | 45.4,29.6 47,28 58,28 59,29 59,31 60,32 61.6,32 C10.2 62,34 v63,35 | INA3.4 37.2,56.2 37.2,53.6 C3.1 | 23.2,54.2 23.2,57.2 | v13,56 13,56.4 12.2,57.2 | C6.1 v13,36 13,37.4 INA6.4 11.58,38.19 11.11,38.66 11.11,38.95 10.28,39.77 10.27,39.76 SJ11.1 10.63,39.76 | 24,35 24,37.4 INA9.4 | v32,60.85 31.85,60.85 31,60 SJ9.1 | v65,35 67,35 | SJ17.1 21.42,39.76 22.3,38.88 22.3,38.51 22.63,38.19 23,38.19
  Top 0.406: 46.16,20.58 R3.2 | C13.2 C8.2 45.4,29.6 45.4,29.4 44,28 43,28 42,27 | C11.2 70,32.6 70,23 68,21 | 46,20.58 R1.2 42.42,20.58 42,21 42,27 | R21.1 42.58,44.58 41,43 41,28 42,27
  Top 0.813: SJ6.1 SJ9.1
  Top 1.016: SJ2.1 SJ1.1 | SJ8.1 SJ7.1 | SJ12.1 SJ11.1 | SJ18.1 SJ17.1 | C13.2 45.4,29.6 | C12.1 C11.2
  Bottom 0.152: v40,48 40,59 v41,60 52,60 v53,59 | v13,56 14,55 14,37 v13,36 14,35 v22.43,35 25,35 32,42 v32,60.85 32,61 31,62 20.15,62 v19,60.85
  Bottom 0.305: v63,35 v65,35
  Bottom 1.016: JP2.11 JP2.12
ADC1
  Top 0.152: IC1.4 54.53,21.54 55.73,22.74 | IC1.2 55.73,25.73 57,27 62,27 64,29 64,37 60,41 57.88,41 57.25,41.63 U1.9
  Top 0.305: IC1.2 55.73,22.74
ADC2
  Top 0.152: IC1.6 54,19 | 54,19 54.46,18.54 54.46,15 | U1.15 60.25,41.18 64.31,37.13 64.31,28.87 62.13,26.7 57.7,26.7 56.47,25.47 56.47,21.47 54,19
  Top 0.305: IC1.9 54.46,15 54.46,15.46
ADC3
  Top 0.152: IC1.12 58.27,16.15 58.58,16.46 IC1.14 62.46,16.46 63,17 71,17 73,19 73,39 72,40 67,40 66,41 66,45 64.25,46.75 U1.20
ADC4
  Top 0.152: IC1.18 59.58,21.54 | 59.58,21.54 58.04,23.07 IC1.20 | U1.26 65.37,49.75 67,48.12 67,42 68,41 72,41 74,39 74,18 68,12 58,12 56.63,13.37 56.6,13.37 56.26,13.72 56.26,18.22 59.58,21.54
BAT+  (via drill 0.35)
  Top 0.152: R9.1 31.71,62.98 35.38,59.31 35.38,58.84 35.74,58.48 INA3.2
  Top 0.305: R9.1 v33,65
  Bottom 0.406: v33,65 33,67 31,69 26,69 23.85,71.15 JP2.5
  Bottom 1.27: JP2.5 JP2.6 26.75,81.27 74.73,81.27 81,75 81,36 81,22.46 80,21.46 X8.1
BAT_OUT
  Top 0.406: INA3.1 36.21,62.61 R9.2
BOOT  (via drill 0.35)
  Top 0.152: R14.2 47,39.58 47,46 48.25,47.25 U1.60 52.17,47.25 52.42,47 v53.39,47 | X7.8 76.38,62 v74,62
  Bottom 0.152: v74,62 71,59 65,59 64,58 64,55 56,47 v53.39,47
CAN1_RX
  Top 0.152: U1.44 55.25,56.25 56,57 56,61.3 CAN1.4
CAN1_TX
  Top 0.152: CAN1.1 52.09,58.91 54.75,56.25 U1.45
CAN_H  (via drill 0.35)
  Top 0.152: R15.1 44.29,65.29 43.29,65.29 | v39,67 40.71,65.29 43.29,65.29 | 43.29,65.29 47,69 52,69 53.37,67.64 CAN1.7
  Bottom 0.152: v39,67 38,68 38,77 36.63,78.37 JP2.16
CAN_L  (via drill 0.35)
  Top 0.152: CAN1.6 54.63,68.36 53,70 46.58,70 45,68.42 R15.2 v41.58,68.42
  Bottom 0.152: JP2.18 39.09,78.23 40.08,77.24 40.08,69.92 v41.58,68.42
GND  (via drill 0.35)  (45 unrouted)
  Top 0.305: SJ3.2 21.4,70.4 22,71 v22,73
  Bottom 0.305: 18.77,75.77 JP2.1 | v22,73 22,75.14 JP2.3
  pour Top: 64,0 83,0 arc90 86,3 86,13.5 arc90 84.5,15 arc-90 83,16.5 83,69.5 arc-90 84.5,71 arc90 86,72.5 86,83 arc90 83,86 62.5,86 arc90 61,84.5 arc-90 59.5,83 26.5,83 arc-90 25,84.5 arc90 23.5,86 3,86 arc90 0,83 0,72.5 arc90 1.5,71 arc-90 3,69.5 3,16.5 arc-90 1.5,15 arc90 0,13.5 0,3 arc90 3,0 22,0 arc90 25,3 arc-90 28,6 58,6 arc-90 61,3 arc90
  pour Bottom: 64,0 83,0 arc90 86,3 86,13.5 arc90 84.5,15 arc-90 83,16.5 83,69.5 arc-90 84.5,71 arc90 86,72.5 86,83 arc90 83,86 62.5,86 arc90 61,84.5 arc-90 59.5,83 26.5,83 arc-90 25,84.5 arc90 23.5,86 3,86 arc90 0,83 0,72.5 arc90 1.5,71 arc-90 3,69.5 3,16.5 arc-90 1.5,15 arc90 0,13.5 0,3 arc90 3,0 22,0 arc90 25,3 arc-90 28,6 58,6 arc-90 61,3 arc90
LBK  (via drill 0.35)
  Top 0.152: U1.38 58.25,55.37 59,56.12 v59,65 | CAN1.5 55.91,67.6 56.3,68 v57,68
  Bottom 0.152: v59,65 59,66 v57,68
MCO  (via drill 0.35)
  Top 0.152: X7.9 74.38,63.38 v74,63 | v55,48 54.25,47.25 54.25,45.4 55.25,44.4 U1.5
  Bottom 0.152: v74,63 71,60 65,60 63,58 63,55 56,48 v55,48
MISO_1  (via drill 0.35)
  Top 0.152: v65.63,47.63 65.63,47.72 65.6,47.75 U1.22
  Bottom 0.152: JP2.13 34.01,74.83 37,71.84 37,67 39,65 47,65 51,69 73,69 74,70 76,70 79,67 79,56 70.63,47.63 v65.63,47.63
MOSI_1  (via drill 0.35)
  Top 0.152: U1.23 58.25,48.25 v57,47 | v38.01,62 38.01,64.99 v37,66
  Bottom 0.152: JP2.14 34.01,78.01 33,77 33,75 36,72 36,67 v37,66 | v57,47 56,46 40,46 38.01,47.99 v38.01,62
N$2
  Top 0.152: U1.3 Y1.P$4 52,36.35 C2.2
  Top 0.305: 54,38.85 Y1.P$4 | 51.6,32.4 C2.2
N$3
  Top 0.813: R23.2 34.58,16.42 34.54,16.46 Q1.G
N$4
  Top 0.152: U1.4 54.75,40.02 55.13,39.65 55.13,36.28 Y1.P$1 | 56.4,33 55,33 54,34 54,35
  Top 0.305: 54,35 54.4,35.4 Y1.P$1 54.6,35.4 | C5.2 56.4,33
N$5
  Top 0.152: C13.1 44.6,36 48,36 52,40 52,44.65 U1.64
N$6  (via drill 0.35)
  Top 0.305: 6.88,57.12 SJ2.2 | R5.2 6.88,53.52 6.88,57.12 | INA1.8 14.81,59.19 v14,60 | v8.67,57.72 8.06,57.12 6.88,57.12
  Bottom 0.305: v14,60 9.95,60 8.67,58.72 v8.67,57.72
N$7
  Top 0.152: 10,57 SJ1.2 | INA1.7 14.34,58.48 13.98,58.13 13.98,55.02 15,54 15,53 14,52 11,52 10,53 R2.2
  Top 0.305: R2.2 10,57
N$8
  Top 0.305: INA3.8 38.81,65.19 37,67 31,67 29,65 29,58 29.76,57.24 SJ9.2 R8.2
N$9
  Top 0.152: INA3.7 38.34,58.48 37.98,58.13 37.98,56.89 38,56.87 38,55 39,54 39,53 38,52 35.4,52 R7.2
  Top 0.305: SJ6.2 R7.2
N$10
  Top 0.305: R11.2 SJ8.2 16.76,57.24 16,58 16,65 18,67 24,67 26,65 26,59.33 INA4.8
N$11
  Top 0.152: INA4.7 25.34,58.48 24.98,58.13 24.98,56.02 26,55 26,53 25,52 22.4,52 R10.2
  Top 0.305: R10.2 SJ7.2
N$12
  Top 0.152: LED1.A 66.45,53.13 59.45,53.13 58.75,53.83 U1.37
N$13
  Top 0.152: LED1.C R28.2
N$14  (via drill 0.35)
  Top 0.305: SJ12.2 7,37 | 7,37 R17.2 | INA6.8 14.87,40.13 14,41 v13,41 | v8.67,38 7.67,37 7,37
  Bottom 0.305: v13,41 10,41 8.67,39.67 v8.67,38
N$15
  Top 0.152: INA6.7 14.34,39.48 13.98,39.13 13.98,36.02 15,35 15,34 14,33 11.4,33 R16.2
  Top 0.305: SJ11.2 R16.2
N$20  (via drill 0.35)
  Top 0.305: SJ18.2 19.24,37 v20,37 | v26,41 INA9.8
  Top 0.406: R26.2 SJ18.2
  Bottom 0.305: v20,37 24,37 26,39 v26,41
N$21
  Top 0.152: INA9.7 25.34,39.48 24.98,39.13 24.98,36.02 26,35 26,34 25,33 22.4,33 R25.2
  Top 0.406: R25.2 SJ17.2
NRST  (via drill 0.35)
  Top 0.152: X7.7 74.12,60.88 73,62 73,65.4 71.2,67.2 70.7,66.7 | C7.2 70.7,66.7 | 70.7,66.7 68,64 66,64 62.85,60.85 S1.2 v62,59 | U1.7 56.25,49.25 v58,51
  Bottom 0.152: v58,51 62,55 v62,59
PAINEL1_OUT  (via drill 0.35)
  Top 0.152: 12.21,62.61 R6.2
  Top 0.406: INA1.1 12.21,62.61
  Top 0.61: R6.2 12.58,62.58 13,63 v13,67 | v13,72 13,74.12 X1.1
  Bottom 0.61: v13,67 v13,72
PAINEL1_TO_DIODE  (via drill 0.35)
  Top 0.152: v10,63 11,62 11,59.7 11.38,59.31 11.38,58.84 11.74,58.48 INA1.2
  Top 0.61: D1.A 32.98,34 39,34 40,35 40,46 37,49 v29,49 | v10,63 7,63 R6.1
  Bottom 0.61: v29,49 15,63 v10,63
PAINEL2_OUT  (via drill 0.35)
  Top 0.305: R12.2 23.58,59.51 INA4.1
  Top 0.61: R12.2 23.58,63.98 21.56,66 v21,66 | v11,11 13.38,8.62 X2.1
  Bottom 0.61: v21,66 8,66 6,64 6,16 v11,11
PAINEL2_TO_DIODE  (via drill 0.35)
  Top 0.152: v21,61 21,60.7 22.38,59.31 22.38,58.84 22.74,58.48 INA4.2
  Top 0.61: R12.1 19.02,62.98 v21,61 | v31,44 33,42 35,42 D2.A
  Bottom 0.61: v21,61 29,61 31,59 v31,44
PAINEL3_OUT  (via drill 0.35)
  Top 0.152: INA6.1 12.21,43.61 R18.2
  Top 0.61: X3.1 75,74.12 v75,69 | v9,47 12.02,43.98 R18.2
  Bottom 0.61: v9,47 7,49 7,62.18 8.82,64 70,64 v75,69
PAINEL3_TO_DIODE
  Top 0.152: 6.98,45.98 R18.1 9.71,43.98 11.38,42.31 11.38,39.84 11.74,39.48 INA6.2
  Top 0.61: R18.1 5.98,43.98 4.4,42.4 4.4,29.6 7,27 26,27 28,25 36,25 38,27 38,31 36.98,32.02 D3.A
PAINEL4_OUT  (via drill 0.35)
  Top 0.305: R27.2 23.58,40.51 INA9.1
  Top 0.61: R27.2 26.02,43.98 28,42 v28,36 | X4.1 67.88,9 v65,9
  Top 0.813: 69.38,7.62 X4.1
  Bottom 0.61: v28,36 28,34 53,9 v65,9
PAINEL4_TO_DIODE
  Top 0.152: R27.1 18,44 20.7,44 22.38,42.31 22.38,39.84 22.74,39.48 INA9.2
  Top 0.61: 18,43 18,44 18,46 19,47 25,47 30.98,41.02 D4.A
PWM_MOS  (via drill 0.35)
  Top 0.152: U1.14 59.75,42.11 v59.64,42 | v30,13 36.42,13 R23.1
  Top 0.813: R24.1 R23.1
  Bottom 0.152: v59.64,42 33,42 26,35 26,15 28,13 v30,13
RES-
  Bottom 1.016: Q1.D 41,19 52.4,7.6 66.6,7.6 74,15 74,21 77,24 X8.2
SCL_1  (via drill 0.35)
  Top 0.152: INA3.5 39.99,56 | 39.99,56 40,56 | R22.2 46.42,50 48.17,48.25 U1.58 | R22.2 43.42,52 41,52 40,53 40,55.99 39.99,56 | v47,67 47.3,66.69 47.3,51.88 R22.2
  Bottom 0.152: v47,67 46.86,67 46.25,66.39 44.75,66.39 41.63,69.51 JP2.19
SCL_2  (via drill 0.35)
  Top 0.152: INA1.5 15,56.99 v15,55 | INA6.5 15,37.99 v15,37 | INA9.5 26,37.99 v26,37 | INA4.5 26.3,56.69 26.3,52.88 v27.09,52.09 | U1.34 60.25,55.37 61.88,57 62,57 | R20.1 62,57 | 62,57 61.53,56.53 v61.39,56.53
  Bottom 0.152: v15,55 v15,37 16,36 25,36 v26,37 30,41 30,49.18 v27.09,52.09 26.9,52.09 18.39,60.6 18.39,61.82 19.87,63.3 54.62,63.3 v61.39,56.53
SCLK_1  (via drill 0.35)
  Top 0.152: U1.21 59.25,47.25 v57,45 | v35,62 v35,66
  Bottom 0.152: v35,62 37,60 37,47 39,45 v57,45 | v35,66 35,72 32.7,74.31 32.7,78.46 33.6,79.36 34.42,79.36 35,78.78 35,77.66 36.55,76.11 JP2.15
SDA_1  (via drill 0.35)
  Top 0.152: INA3.6 39.28,57.84 41,56.12 v41,54 44,54 47,57 47,66 v46,67 | U1.59 48.17,47.75 46.42,46 R21.2 45.42,46.58 v44,48
  Bottom 0.152: v44,48 42,48 41,49 v41,54 | v46,67 46,69 43,72 43,79 42,80 39,80 38,79 38,78.06 39.09,76.97 JP2.17
SDA_2  (via drill 0.35)
  Top 0.152: INA1.6 15.28,57.84 16,57.12 v16,57 | v27,39 26.84,38.84 INA9.6 | INA6.6 15.84,38.84 v16,39 | v28,48.5 28,56.12 26.28,57.84 INA4.6 26.25,57.84 26.27,57.82 27,58.55 27,66 29,68 37,68 40,65 40,59 v42,57 | R19.1 65,61 v60,56 59.75,55.75 U1.35
  Bottom 0.152: v28,48.5 28,40 v27,39 24.3,36.3 16.7,36.3 16,37 v16,39 v16,57 | v42,57 59,57 v60,56
SOL+  (via drill 0.6)
  Top 0.813: D2.C 38,36.98 39,37.98 39,44 36,47 26.22,47 25.28,47.94 6.06,47.94 5,49 5,66 7,68 24,68 26,70 v26,72
  Top 1.016: D2.C D4.C | 30.98,36.98 27,33 27,30 29,28 31.02,28 | D1.C D3.C
  Top 1.27: 31.02,28 D1.C | D4.C 30.98,36.98
  Bottom 0.813: JP2.7 26,75.44 v26,72
SOL-  (via drill 0.55)  (1 unrouted)
  Top 0.305: v15,9.03 16.06,7.94
  Top 0.61: X2.2 16.06,7.94 19,10.88 67.95,10.88 70.62,8.2 X4.2 70.62,8.62 | v7,71 7.6,71.6 SJ3.1
  Top 0.813: SJ3.1 10,72 11.38,73.38 X1.2 11.38,78.38 14,81 23.76,81 JP2.8 29.02,81 72,81 73.38,79.62 X3.2 | X2.2 15.62,7.62
  Bottom 0.508: v15,9.03 11,9 4.25,15.76 4.25,68.11
  Bottom 0.61: v7,71 4.4,68.4 4.4,68.11
SWCLK  (via drill 0.35)
  Top 0.152: 51.45,52.7 U1.49 50,54.15 50,63 52,65 56.03,65 63.03,72 71,72 v75.09,67.91 | 76.56,58.44 X7.5 77.38,58.38 v78,59
  Bottom 0.152: v75.09,67.91 78,65 v78,59
SWDIO
  Top 0.152: U1.46 54.25,55.75 51,59 51,63 52,64 56,64 63,71 71,71 76.15,65.85 78.15,65.85 79,65 79,60 78.62,59.62 X7.6
SWO  (via drill 0.35)
  Top 0.152: U1.55 49.25,49.75 48,51 v48,67 | v71,70 76.38,64.62 X7.10
  Bottom 0.152: v48,67 51,70 v71,70
THERM1  (via drill 0.35)
  Top 0.152: X9.1 75.38,38 v75,38
  Top 0.305: R1.1 46.58,26 51.76,26 v51.88,25.88 IC1.3
  Bottom 0.152: v75,38 73,38 68,33 68,12 67,11 54,11 51,14 51,25 v51.88,25.88 52,26
THERM2  (via drill 0.35)
  Top 0.152: X9.2 74.38,40.38 v74,40 | v53,13 52.14,13.86 52.14,16.46
  Top 0.305: IC1.8 52.14,16.46 49,19.6 R3.1
  Bottom 0.152: v74,40 67,33 67,13 66,12 54,12 v53,13
THERM3  (via drill 0.35)
  Top 0.152: X9.3 74.62,41.62 v74,41
  Top 0.305: R4.1 v65.71,13.29 65.42,13 61,13 59.54,14.46 IC1.13
  Bottom 0.152: v65.71,13.29 65.71,32.71 v74,41
THERM4  (via drill 0.35)
  Top 0.152: X9.4 74.88,42.88 v74,42
  Top 0.305: 59.54,23.54 IC1.19 59.54,24.54 61,26 v65,26 66.42,26 R13.1
  Bottom 0.152: v65,26 65,33 v74,42
U_RX  (via drill 0.35)
  Top 0.152: U1.17 63.75,45.25 64,45 64,40 v65,39 | X7.3 77.12,55.88 78,55 v78,54
  Bottom 0.152: v65,39 66,38 69,38 78,47 v78,54
U_TX  (via drill 0.35)
  Top 0.152: 76.38,57 X7.4 74.88,57.12 v74,58 | U1.16 60.75,43.25 61,43 v63,43
  Bottom 0.152: v74,58 66,58 65,57 65,45 v63,43